# EAGLE schematic SI5351_Arduinol (EAGLE 9.6.2)
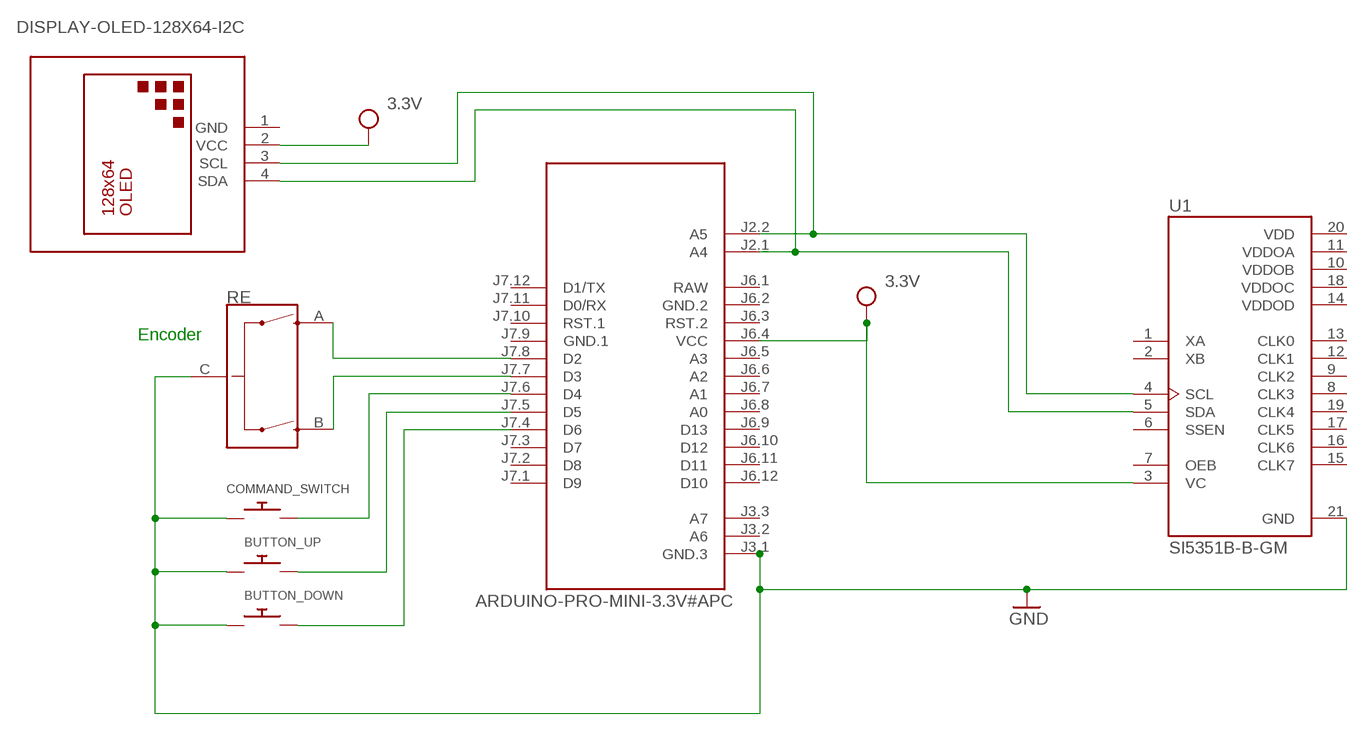
[diagram p0: schematic, sheet 1]

## Parts
BUTTON_DOWN  SWITCH_PUSHBUTTONC&K_KSS  [BTN_CK_KSS]
BUTTON_UP  SWITCH_PUSHBUTTONC&K_KSS  [BTN_CK_KSS]
COMMAND_SWITCH  SWITCH_PUSHBUTTONC&K_KSS  [BTN_CK_KSS]
M2  ARDUINO-PRO-MINI-3.3V#APC  [ARDUINO-PRO-MINI#APC]
RE  ENCODER  [ENCODER-16MM-QUAD]
U1  SI5351B-B-GM  [QFN50P400X400X90-21N]
U$2  DISPLAY-OLED-128X64-I2C  [DISPLAY-OLED-128X64-I2C]

## Nets
GND: BUTTON_DOWN.P$1 BUTTON_UP.P$1 COMMAND_SWITCH.P$1 M2.J3.1(GND.3) RE.C U1.21(GND)
N$2: BUTTON_UP.P$2 M2.J7.5(D5)
N$3: BUTTON_DOWN.P$2 M2.J7.4(D6)
N$7: M2.J2.1(A4) U1.5(SDA) U$2.4(SDA)
N$8: M2.J2.2(A5) U1.4(SCL) U$2.3(SCL)
N$10: M2.J7.8(D2) RE.A
N$11: M2.J7.7(D3) RE.B
N$12: COMMAND_SWITCH.P$2 M2.J7.6(D4)
VCC: M2.J6.4(VCC) U1.3(VC) U$2.2(VCC)
Unconnected: M2.J3.2(A6) M2.J3.3(A7) M2.J6.3(RST.2) M2.J6.5(A3) M2.J6.6(A2) M2.J6.7(A1) M2.J6.8(A0) M2.J6.9(D13) M2.J6.10(D12) M2.J6.11(D11) M2.J6.12(D10) M2.J7.1(D9) M2.J7.2(D8) M2.J7.3(D7) M2.J7.10(RST.1) M2.J7.11(D0/RX) M2.J7.12(D1/TX) U1.1(XA) U1.2(XB) U1.6(SSEN) U1.7(OEB) U1.8(CLK3) U1.9(CLK2) U1.12(CLK1) U1.13(CLK0) U1.15(CLK7) U1.16(CLK6) U1.17(CLK5) U1.19(CLK4)

## Notes on the sheet
- Encoder

## Power pins joined to a net without a drawn wire
GND: U$2.1(GND)
GND.1: M2.J7.9(GND.1)
GND.2: M2.J6.2(GND.2)
RAW: M2.J6.1(RAW)
VDD: U1.20(VDD)
VDDOA: U1.11(VDDOA)
VDDOB: U1.10(VDDOB)
VDDOC: U1.18(VDDOC)
VDDOD: U1.14(VDDOD)

## Library data of the parts
BUTTON_DOWN BUTTON_UP COMMAND_SWITCH = adafruit:SWITCH_PUSHBUTTON: Buttons SOFTTOUCHSMD_SJ - Soft touch temporary push button (Super Junk Akihabara) Compatible with SKPMANE010 [Mouser: 688-SKPMAN] C&K_KSS = Digikey: KSS221GLFS
M2 = diy-modules:ARDUINO-PRO-MINI-*#APC: Arduino Pro Mini (and compatible devices) with angle programming connector More details available here: https://www.arduino.cc/en/Main/ArduinoBoardProMini Click here to find device on ebay.com <http://www.ebay.com/sch/arduino+pro+mini>
RE = SparkFun-Switches:ENCODER: Rotary Encoder Encoders rotate similarly to potentiometers, but they’re different from potentiometers in that an encoder has full rotation without limits. They output gray code so that you can tell how much and in which direction the encoder has been turned. SparkFun Products Used on the https://www.sparkfun.com/products/11043 (COM-11043); PROD_ID: RES-11299
U1 = SI5351B-B-GM:SI5351B-B-GM: Programmable PLL Clock Generator Single 0.0025MHz to 200MHz 20-Pin QFN Bulk; AVAILABILITY: Unavailable; DESCRIPTION: IC CLK GENERATOR 200MHZ 20QFN; MF: Silicon Labs; MP: SI5351B-B-GM; PACKAGE: QFN-20 Silicon Labs; PRICE: None
U$2 = diy-modules:DISPLAY-OLED-128X64-I2C: 128x64 Dot Matrix OLED Module based on SSD1306 chip Variant with I2C interface More details available here: http://www.instructables.com/id/Monochrome-096-i2c-OLED-display-with-arduino-SSD13/ SSD1306 datasheet: https://cdn-shop.adafruit.com/datasheets/SSD1306.pdf Click here to find device on ebay.com <http://www.ebay.com/sch/oled+display+128x64+iic> Note: There are two variants: I2C and SPI. Search for the proper version.